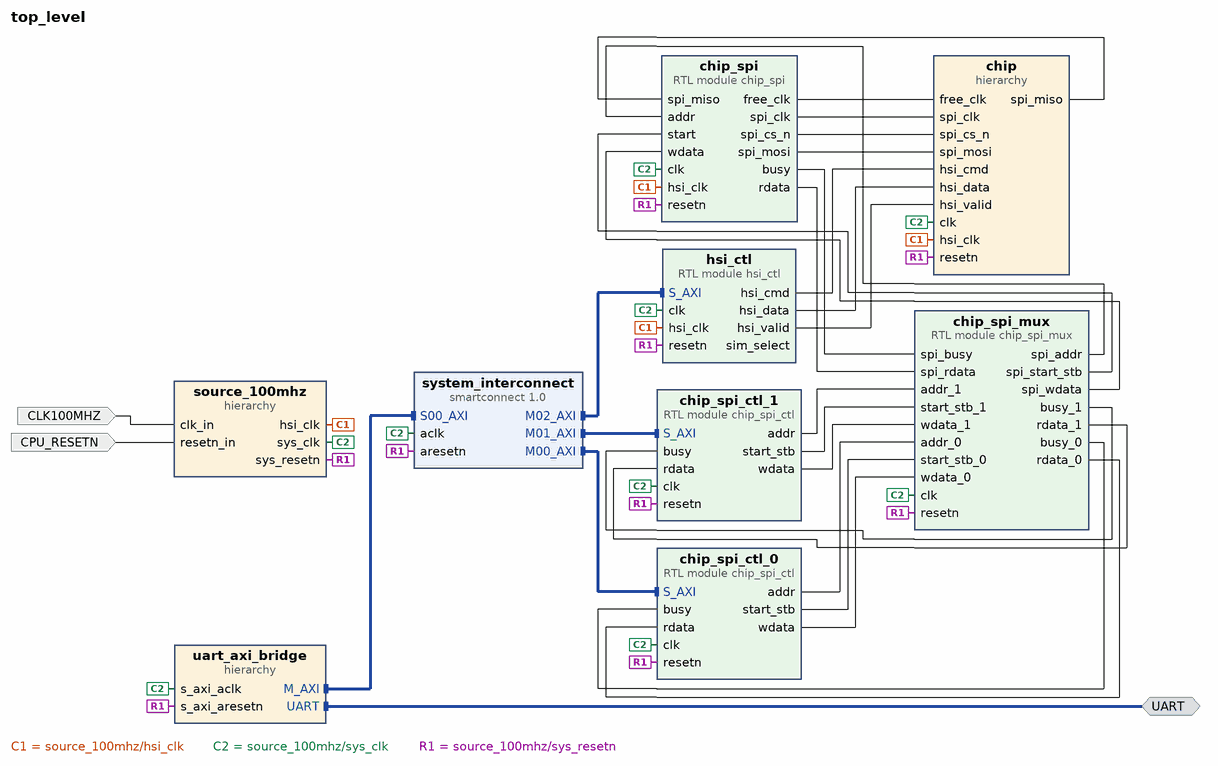
[diagram p0: block diagram of the top level]
# Vivado block design top_level, xc7a100tcsg324-1, Vivado 2021.1
create_bd_design top_level

create_bd_intf_port -mode Master -vlnv xilinx.com:interface:uart_rtl:1.0 UART
create_bd_port -dir I -type clk CLK100MHZ
create_bd_port -dir I -type rst CPU_RESETN

create_bd_cell -type hier source_100mhz
create_bd_cell -type hier uart_axi_bridge
create_bd_cell -type ip -vlnv xilinx.com:ip:smartconnect:1.0 system_interconnect
set_property -dict {CONFIG.NUM_MI 3 CONFIG.NUM_SI 1} [get_bd_cells system_interconnect]
create_bd_cell -type module -reference chip_spi_ctl chip_spi_ctl_0
create_bd_cell -type module -reference chip_spi_ctl chip_spi_ctl_1
create_bd_cell -type module -reference chip_spi_mux chip_spi_mux
create_bd_cell -type hier chip
create_bd_cell -type module -reference hsi_ctl hsi_ctl
create_bd_cell -type module -reference chip_spi chip_spi

# ---- hierarchy /source_100mhz ----
current_bd_instance /source_100mhz
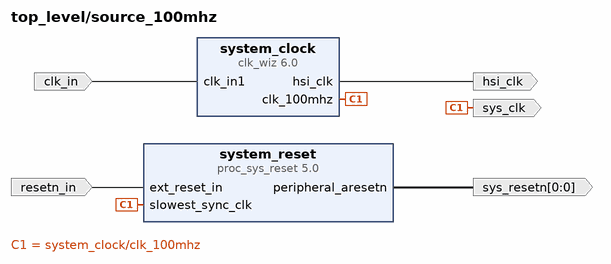
[diagram p1: block diagram inside /source_100mhz]
create_bd_pin -dir I -type clk clk_in
create_bd_pin -dir I -type rst resetn_in
create_bd_pin -dir O -type clk sys_clk
create_bd_pin -dir O -from 0 -to 0 sys_resetn
create_bd_pin -dir O hsi_clk

create_bd_cell -type ip -vlnv xilinx.com:ip:clk_wiz:6.0 system_clock
set_property -dict [list \
  CONFIG.CLKOUT1_JITTER 144.719 \
  CONFIG.CLKOUT1_PHASE_ERROR 114.212 \
  CONFIG.CLKOUT2_JITTER 151.652 \
  CONFIG.CLKOUT2_PHASE_ERROR 114.212 \
  CONFIG.CLKOUT2_REQUESTED_OUT_FREQ 80 \
  CONFIG.CLKOUT2_USED true \
  CONFIG.CLK_OUT1_PORT clk_100mhz \
  CONFIG.CLK_OUT2_PORT hsi_clk \
  CONFIG.MMCM_CLKFBOUT_MULT_F 8.000 \
  CONFIG.MMCM_CLKOUT0_DIVIDE_F 8.000 \
  CONFIG.MMCM_CLKOUT1_DIVIDE 10 \
  CONFIG.NUM_OUT_CLKS 2 \
  CONFIG.USE_LOCKED false \
  CONFIG.USE_RESET false \
] [get_bd_cells system_clock]
create_bd_cell -type ip -vlnv xilinx.com:ip:proc_sys_reset:5.0 system_reset

# ---- hierarchy /uart_axi_bridge ----
current_bd_instance /uart_axi_bridge
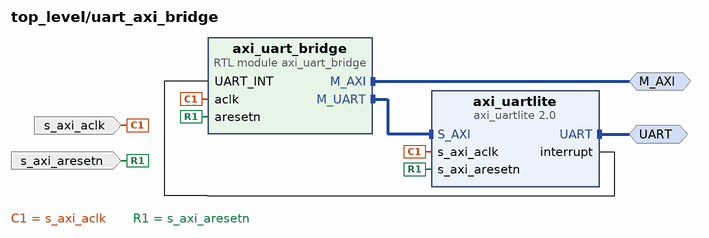
[diagram p2: block diagram inside /uart_axi_bridge]
create_bd_intf_pin -mode Master -vlnv xilinx.com:interface:uart_rtl:1.0 UART
create_bd_intf_pin -mode Master -vlnv xilinx.com:interface:aximm_rtl:1.0 M_AXI
create_bd_pin -dir I -type clk s_axi_aclk
create_bd_pin -dir I -type rst s_axi_aresetn

create_bd_cell -type module -reference axi_uart_bridge axi_uart_bridge
create_bd_cell -type ip -vlnv xilinx.com:ip:axi_uartlite:2.0 axi_uartlite
set_property -dict {CONFIG.C_BAUDRATE 115200} [get_bd_cells axi_uartlite]

# ---- hierarchy /chip ----
current_bd_instance /chip
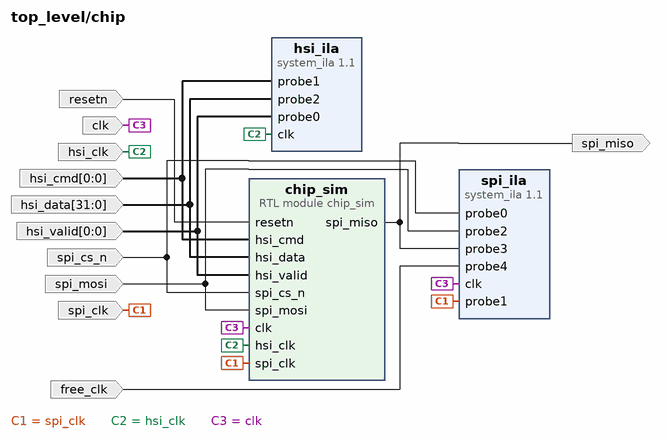
[diagram p3: block diagram inside /chip]
create_bd_pin -dir I -type clk clk
create_bd_pin -dir I spi_cs_n
create_bd_pin -dir I -type clk spi_clk
create_bd_pin -dir I spi_mosi
create_bd_pin -dir I -type rst resetn
create_bd_pin -dir I -type clk hsi_clk
create_bd_pin -dir I -from 31 -to 0 hsi_data
create_bd_pin -dir I -from 0 -to 0 hsi_cmd
create_bd_pin -dir I -from 0 -to 0 hsi_valid
create_bd_pin -dir O spi_miso
create_bd_pin -dir I free_clk

create_bd_cell -type ip -vlnv xilinx.com:ip:system_ila:1.1 spi_ila
set_property -dict {CONFIG.C_DATA_DEPTH 2048 CONFIG.C_MON_TYPE NATIVE CONFIG.C_NUM_OF_PROBES 5} [get_bd_cells spi_ila]
create_bd_cell -type ip -vlnv xilinx.com:ip:system_ila:1.1 hsi_ila
set_property -dict {CONFIG.C_MON_TYPE NATIVE CONFIG.C_NUM_OF_PROBES 3} [get_bd_cells hsi_ila]
create_bd_cell -type module -reference chip_sim chip_sim

# ---- connections ----

current_bd_instance /source_100mhz
connect_bd_net -net clk_in1_0_1 [get_bd_pins clk_in] [get_bd_pins system_clock/clk_in1]
connect_bd_net -net ext_reset_in_0_1 [get_bd_pins resetn_in] [get_bd_pins system_reset/ext_reset_in]
connect_bd_net [get_bd_pins system_clock/clk_100mhz] [get_bd_pins sys_clk] [get_bd_pins system_reset/slowest_sync_clk]
connect_bd_net [get_bd_pins system_clock/hsi_clk] [get_bd_pins hsi_clk]
connect_bd_net [get_bd_pins system_reset/peripheral_aresetn] [get_bd_pins sys_resetn]

current_bd_instance /uart_axi_bridge
connect_bd_intf_net [get_bd_intf_pins M_AXI] [get_bd_intf_pins axi_uart_bridge/M_AXI]
connect_bd_intf_net [get_bd_intf_pins axi_uart_bridge/M_UART] [get_bd_intf_pins axi_uartlite/S_AXI]
connect_bd_intf_net [get_bd_intf_pins UART] [get_bd_intf_pins axi_uartlite/UART]
connect_bd_net [get_bd_pins axi_uartlite/interrupt] [get_bd_pins axi_uart_bridge/UART_INT]
connect_bd_net -net source_100mhz_sys_clk [get_bd_pins s_axi_aclk] [get_bd_pins axi_uartlite/s_axi_aclk] [get_bd_pins axi_uart_bridge/aclk]
connect_bd_net -net source_100mhz_sys_resetn [get_bd_pins s_axi_aresetn] \
  [get_bd_pins axi_uartlite/s_axi_aresetn] [get_bd_pins axi_uart_bridge/aresetn]

current_bd_instance /chip
connect_bd_net [get_bd_pins chip_sim/spi_miso] [get_bd_pins spi_miso] [get_bd_pins spi_ila/probe3]
connect_bd_net -net chip_spi_spi_clk [get_bd_pins spi_clk] [get_bd_pins spi_ila/probe1] [get_bd_pins chip_sim/spi_clk]
connect_bd_net -net chip_spi_spi_cs_n [get_bd_pins spi_cs_n] [get_bd_pins spi_ila/probe0] [get_bd_pins chip_sim/spi_cs_n]
connect_bd_net -net chip_spi_spi_mosi [get_bd_pins spi_mosi] [get_bd_pins spi_ila/probe2] [get_bd_pins chip_sim/spi_mosi]
connect_bd_net [get_bd_pins free_clk] [get_bd_pins spi_ila/probe4]
connect_bd_net -net hsi_ctl_hsi_cmd [get_bd_pins hsi_cmd] [get_bd_pins hsi_ila/probe1] [get_bd_pins chip_sim/hsi_cmd]
connect_bd_net -net hsi_ctl_hsi_data [get_bd_pins hsi_data] [get_bd_pins hsi_ila/probe2] [get_bd_pins chip_sim/hsi_data]
connect_bd_net -net hsi_ctl_hsi_valid [get_bd_pins hsi_valid] [get_bd_pins hsi_ila/probe0] [get_bd_pins chip_sim/hsi_valid]
connect_bd_net -net source_100mhz_hsi_clk [get_bd_pins hsi_clk] [get_bd_pins hsi_ila/clk] [get_bd_pins chip_sim/hsi_clk]
connect_bd_net -net source_100mhz_sys_clk [get_bd_pins clk] [get_bd_pins spi_ila/clk] [get_bd_pins chip_sim/clk]
connect_bd_net -net source_100mhz_sys_resetn [get_bd_pins resetn] [get_bd_pins chip_sim/resetn]

current_bd_instance /
connect_bd_intf_net -intf_net axi_uartlite_UART [get_bd_intf_ports UART] [get_bd_intf_pins uart_axi_bridge/UART]
connect_bd_intf_net [get_bd_intf_pins chip_spi_ctl_0/S_AXI] [get_bd_intf_pins system_interconnect/M00_AXI]
connect_bd_intf_net [get_bd_intf_pins chip_spi_ctl_1/S_AXI] [get_bd_intf_pins system_interconnect/M01_AXI]
connect_bd_intf_net [get_bd_intf_pins system_interconnect/M02_AXI] [get_bd_intf_pins hsi_ctl/S_AXI]
connect_bd_intf_net [get_bd_intf_pins uart_axi_bridge/M_AXI] [get_bd_intf_pins system_interconnect/S00_AXI]
connect_bd_net [get_bd_pins chip_spi/busy] [get_bd_pins chip_spi_mux/spi_busy]
connect_bd_net [get_bd_pins chip_spi_ctl_1/addr] [get_bd_pins chip_spi_mux/addr_1]
connect_bd_net -net chip_spi_ctl_1_start [get_bd_pins chip_spi_ctl_1/start_stb] [get_bd_pins chip_spi_mux/start_stb_1]
connect_bd_net [get_bd_pins chip_spi_ctl_1/wdata] [get_bd_pins chip_spi_mux/wdata_1]
connect_bd_net -net chip_spi_ctl_addr [get_bd_pins chip_spi_ctl_0/addr] [get_bd_pins chip_spi_mux/addr_0]
connect_bd_net -net chip_spi_ctl_start [get_bd_pins chip_spi_ctl_0/start_stb] [get_bd_pins chip_spi_mux/start_stb_0]
connect_bd_net -net chip_spi_ctl_wdata [get_bd_pins chip_spi_ctl_0/wdata] [get_bd_pins chip_spi_mux/wdata_0]
connect_bd_net [get_bd_pins chip_spi/free_clk] [get_bd_pins chip/free_clk]
connect_bd_net [get_bd_pins chip/spi_miso] [get_bd_pins chip_spi/spi_miso]
connect_bd_net -net chip_spi_mux_addr [get_bd_pins chip_spi_mux/spi_addr] [get_bd_pins chip_spi/addr]
connect_bd_net [get_bd_pins chip_spi_mux/busy_0] [get_bd_pins chip_spi_ctl_0/busy]
connect_bd_net [get_bd_pins chip_spi_mux/busy_1] [get_bd_pins chip_spi_ctl_1/busy]
connect_bd_net [get_bd_pins chip_spi_mux/rdata_0] [get_bd_pins chip_spi_ctl_0/rdata]
connect_bd_net [get_bd_pins chip_spi_mux/rdata_1] [get_bd_pins chip_spi_ctl_1/rdata]
connect_bd_net -net chip_spi_mux_start [get_bd_pins chip_spi_mux/spi_start_stb] [get_bd_pins chip_spi/start]
connect_bd_net -net chip_spi_mux_wdata [get_bd_pins chip_spi_mux/spi_wdata] [get_bd_pins chip_spi/wdata]
connect_bd_net [get_bd_pins chip_spi/rdata] [get_bd_pins chip_spi_mux/spi_rdata]
connect_bd_net [get_bd_pins chip_spi/spi_clk] [get_bd_pins chip/spi_clk]
connect_bd_net [get_bd_pins chip_spi/spi_cs_n] [get_bd_pins chip/spi_cs_n]
connect_bd_net -net clk_in1_0_1 [get_bd_ports CLK100MHZ] [get_bd_pins source_100mhz/clk_in]
connect_bd_net -net ext_reset_in_0_1 [get_bd_ports CPU_RESETN] [get_bd_pins source_100mhz/resetn_in]
connect_bd_net [get_bd_pins hsi_ctl/hsi_cmd] [get_bd_pins chip/hsi_cmd]
connect_bd_net [get_bd_pins hsi_ctl/hsi_data] [get_bd_pins chip/hsi_data]
connect_bd_net [get_bd_pins hsi_ctl/hsi_valid] [get_bd_pins chip/hsi_valid]
# net hsi_ctl_sim_select has one end: hsi_ctl/sim_select
connect_bd_net [get_bd_pins source_100mhz/hsi_clk] [get_bd_pins chip/hsi_clk] [get_bd_pins hsi_ctl/hsi_clk] [get_bd_pins chip_spi/hsi_clk]
connect_bd_net [get_bd_pins source_100mhz/sys_clk] \
  [get_bd_pins uart_axi_bridge/s_axi_aclk] [get_bd_pins system_interconnect/aclk] [get_bd_pins chip_spi_ctl_0/clk] \
  [get_bd_pins chip_spi_ctl_1/clk] [get_bd_pins chip_spi_mux/clk] [get_bd_pins chip/clk] [get_bd_pins hsi_ctl/clk] \
  [get_bd_pins chip_spi/clk]
connect_bd_net [get_bd_pins source_100mhz/sys_resetn] \
  [get_bd_pins uart_axi_bridge/s_axi_aresetn] [get_bd_pins system_interconnect/aresetn] [get_bd_pins chip_spi_ctl_0/resetn] \
  [get_bd_pins chip_spi_ctl_1/resetn] [get_bd_pins chip_spi_mux/resetn] [get_bd_pins chip/resetn] \
  [get_bd_pins hsi_ctl/resetn] [get_bd_pins chip_spi/resetn]
connect_bd_net -net spi_mosi_1 [get_bd_pins chip_spi/spi_mosi] [get_bd_pins chip/spi_mosi]

# ---- address map ----
assign_bd_address -offset 0x0000000000001000 -range 256 -target_address_space [get_bd_addr_spaces uart_axi_bridge/axi_uart_bridge/M_AXI] [get_bd_addr_segs chip_spi_ctl_0/S_AXI/reg0]
assign_bd_address -offset 0x0000000000002000 -range 256 -target_address_space [get_bd_addr_spaces uart_axi_bridge/axi_uart_bridge/M_AXI] [get_bd_addr_segs chip_spi_ctl_1/S_AXI/reg0]
assign_bd_address -offset 0x0000000000003000 -range 256 -target_address_space [get_bd_addr_spaces uart_axi_bridge/axi_uart_bridge/M_AXI] [get_bd_addr_segs hsi_ctl/S_AXI/reg0]
assign_bd_address -offset 0x40600000 -range 64K -target_address_space [get_bd_addr_spaces uart_axi_bridge/axi_uart_bridge/M_UART] [get_bd_addr_segs uart_axi_bridge/axi_uartlite/S_AXI/Reg]

validate_bd_design
save_bd_design
